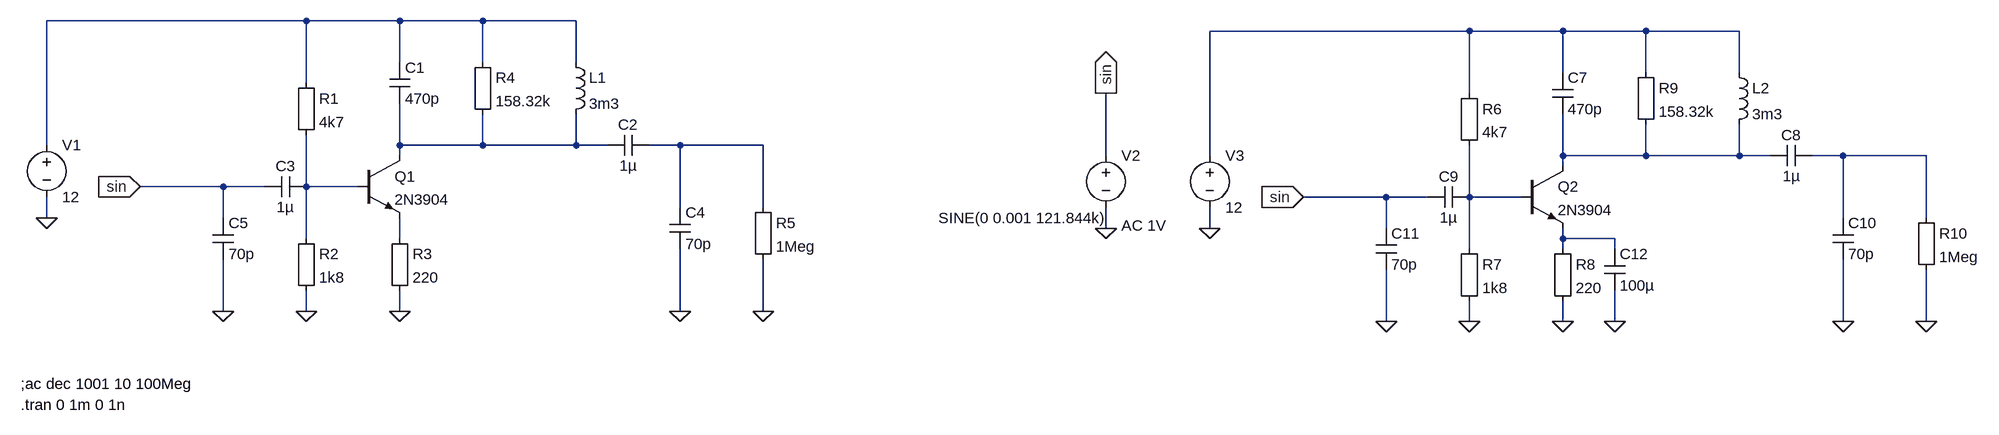
[diagram p0: schematic Verstaerkerschaltung.asc]
Verstaerkerschaltung.asc, the LTspice schematic file:
Version 4
SHEET 1 2552 680
WIRE -32 -64 -432 -64
WIRE 112 -64 -32 -64
WIRE 240 -64 112 -64
WIRE 384 -64 240 -64
WIRE 1760 -48 1360 -48
WIRE 1904 -48 1760 -48
WIRE 2032 -48 1904 -48
WIRE 2176 -48 2032 -48
WIRE 112 0 112 -64
WIRE 240 0 240 -64
WIRE 384 0 384 -64
WIRE 1904 16 1904 -48
WIRE 2032 16 2032 -48
WIRE 2176 16 2176 -48
WIRE -32 32 -32 -64
WIRE 1760 48 1760 -48
WIRE -432 128 -432 -64
WIRE 112 128 112 64
WIRE 240 128 240 80
WIRE 240 128 112 128
WIRE 384 128 384 80
WIRE 384 128 240 128
WIRE 432 128 384 128
WIRE 544 128 496 128
WIRE 672 128 544 128
WIRE 112 144 112 128
WIRE 1200 144 1200 48
WIRE 1360 144 1360 -48
WIRE 1904 144 1904 80
WIRE 2032 144 2032 96
WIRE 2032 144 1904 144
WIRE 2176 144 2176 96
WIRE 2176 144 2032 144
WIRE 2224 144 2176 144
WIRE 2336 144 2288 144
WIRE 2464 144 2336 144
WIRE 1904 160 1904 144
WIRE -160 192 -288 192
WIRE -96 192 -160 192
WIRE -32 192 -32 112
WIRE 48 192 -32 192
WIRE 1632 208 1504 208
WIRE 1696 208 1632 208
WIRE 1760 208 1760 128
WIRE 1840 208 1760 208
WIRE 544 224 544 128
WIRE 672 224 672 128
WIRE -432 240 -432 208
WIRE -160 240 -160 192
WIRE 2336 240 2336 144
WIRE 2464 240 2464 144
WIRE 1200 256 1200 224
WIRE 1360 256 1360 224
WIRE 1632 256 1632 208
WIRE -32 272 -32 192
WIRE 112 272 112 240
WIRE 1904 272 1904 256
WIRE 1984 272 1904 272
WIRE 1760 288 1760 208
WIRE 1904 288 1904 272
WIRE 1984 288 1984 272
WIRE -160 384 -160 304
WIRE -32 384 -32 352
WIRE 112 384 112 352
WIRE 544 384 544 288
WIRE 672 384 672 304
WIRE 1632 400 1632 320
WIRE 1760 400 1760 368
WIRE 1904 400 1904 368
WIRE 1984 400 1984 352
WIRE 2336 400 2336 304
WIRE 2464 400 2464 320
FLAG 112 384 0
FLAG -32 384 0
FLAG -432 240 0
FLAG 544 384 0
FLAG -160 384 0
FLAG 672 384 0
FLAG 1200 256 0
FLAG 1904 400 0
FLAG 1760 400 0
FLAG 1360 256 0
FLAG 2336 400 0
FLAG 1632 400 0
FLAG 2464 400 0
FLAG 1984 400 0
FLAG 1504 208 sin
IOPIN 1504 208 In
FLAG 1200 48 sin
IOPIN 1200 48 Out
FLAG -288 192 sin
IOPIN -288 192 In
SYMBOL cap 96 0 R0
SYMATTR InstName C1
SYMATTR Value 470p
SYMBOL ind 368 -16 R0
SYMATTR InstName L1
SYMATTR Value 3m3
SYMBOL voltage -432 112 R0
WINDOW 123 0 0 Left 2
WINDOW 39 0 0 Left 2
SYMATTR InstName V1
SYMATTR Value 12
SYMBOL npn 48 144 R0
SYMATTR InstName Q1
SYMATTR Value 2N3904
SYMBOL cap 432 144 R270
WINDOW 0 32 32 VTop 2
WINDOW 3 0 32 VBottom 2
SYMATTR InstName C2
SYMATTR Value 1µ
SYMBOL cap -96 208 R270
WINDOW 0 32 32 VTop 2
WINDOW 3 0 32 VBottom 2
SYMATTR InstName C3
SYMATTR Value 1µ
SYMBOL cap 528 224 R0
SYMATTR InstName C4
SYMATTR Value 70p
SYMBOL cap -176 240 R0
SYMATTR InstName C5
SYMATTR Value 70p
SYMBOL voltage 1200 128 R0
WINDOW 123 24 124 Left 2
WINDOW 39 0 0 Left 2
WINDOW 3 -258 112 Left 2
SYMATTR Value2 AC 1V
SYMATTR Value SINE(0 0.001 121.844k)
SYMATTR InstName V2
SYMBOL cap 1888 16 R0
SYMATTR InstName C7
SYMATTR Value 470p
SYMBOL ind 2160 0 R0
SYMATTR InstName L2
SYMATTR Value 3m3
SYMBOL voltage 1360 128 R0
WINDOW 123 0 0 Left 2
WINDOW 39 0 0 Left 2
SYMATTR InstName V3
SYMATTR Value 12
SYMBOL npn 1840 160 R0
SYMATTR InstName Q2
SYMATTR Value 2N3904
SYMBOL cap 2224 160 R270
WINDOW 0 32 32 VTop 2
WINDOW 3 0 32 VBottom 2
SYMATTR InstName C8
SYMATTR Value 1µ
SYMBOL cap 1696 224 R270
WINDOW 0 32 32 VTop 2
WINDOW 3 0 32 VBottom 2
SYMATTR InstName C9
SYMATTR Value 1µ
SYMBOL cap 2320 240 R0
SYMATTR InstName C10
SYMATTR Value 70p
SYMBOL cap 1616 256 R0
SYMATTR InstName C11
SYMATTR Value 70p
SYMBOL cap 1968 288 R0
SYMATTR InstName C12
SYMATTR Value 100µ
SYMBOL Misc\\EuropeanResistor 224 -16 R0
SYMATTR InstName R4
SYMATTR Value 158.32k
SYMBOL Misc\\EuropeanResistor -48 16 R0
SYMATTR InstName R1
SYMATTR Value 4k7
SYMBOL Misc\\EuropeanResistor -48 256 R0
SYMATTR InstName R2
SYMATTR Value 1k8
SYMBOL Misc\\EuropeanResistor 96 256 R0
SYMATTR InstName R3
SYMATTR Value 220
SYMBOL Misc\\EuropeanResistor 656 208 R0
SYMATTR InstName R5
SYMATTR Value 1Meg
SYMBOL Misc\\EuropeanResistor 1744 32 R0
SYMATTR InstName R6
SYMATTR Value 4k7
SYMBOL Misc\\EuropeanResistor 1744 272 R0
SYMATTR InstName R7
SYMATTR Value 1k8
SYMBOL Misc\\EuropeanResistor 2016 0 R0
SYMATTR InstName R9
SYMATTR Value 158.32k
SYMBOL Misc\\EuropeanResistor 1888 272 R0
SYMATTR InstName R8
SYMATTR Value 220
SYMBOL Misc\\EuropeanResistor 2448 224 R0
SYMATTR InstName R10
SYMATTR Value 1Meg
TEXT -472 496 Left 2 !;ac dec 1001 10 100Meg
TEXT -472 528 Left 2 !.tran 0 1m 0 1n

The netlist it stands for:
* Verstaerkerschaltung.asc
C1 N001 N003 470p
L1 N001 N003 3m3
V1 N001 0 12
Q1 N003 N007 N009 0 2N3904
C2 N003 N004 1µ
C3 sin N007 1µ
C4 N004 0 70p
C5 sin 0 70p
V2 sin 0 SINE(0 0.001 121.844k) AC 1V
C7 N002 N005 470p
L2 N002 N005 3m3
V3 N002 0 12
Q2 N005 N008 N010 0 2N3904
C8 N005 N006 1µ
C9 sin N008 1µ
C10 N006 0 70p
C11 sin 0 70p
C12 N010 0 100µ
R4 N001 N003 158.32k
R1 N001 N007 4k7
R2 N007 0 1k8
R3 N009 0 220
R5 N004 0 1Meg
R6 N002 N008 4k7
R7 N008 0 1k8
R9 N002 N005 158.32k
R8 N010 0 220
R10 N006 0 1Meg
.model NPN NPN
.model PNP PNP
.lib standard.bjt
;ac dec 1001 10 100Meg
.tran 0 1m 0 1n
.backanno
.end